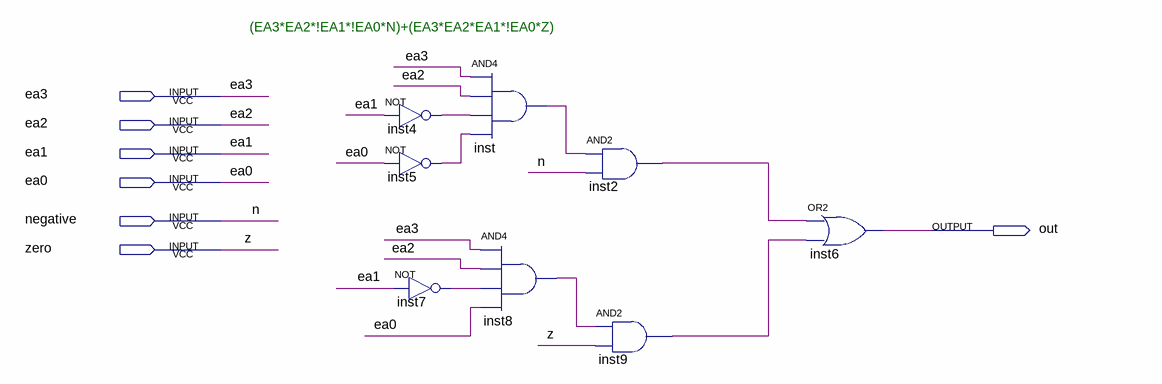
[diagram p0: schematic sheet]
// Quartus schematic jnnorjzz.bdf as structural Verilog: 8 symbols, 7 pins
module jnnorjzz (
  input  ea3,
  input  ea2,
  input  ea1,
  input  ea0,
  input  negative,
  input  zero,
  output out
);

  wire inst2_out, inst4_out, inst5_out, inst7_out, inst8_out, inst9_out, inst_out;

  not inst4 (inst4_out, ea1);
  not inst5 (inst5_out, ea0);
  not inst7 (inst7_out, ea1);
  and inst (inst_out, ea3, ea2, inst4_out, inst5_out);
  and inst8 (inst8_out, ea3, ea2, inst7_out, ea0);
  and inst2 (inst2_out, inst_out, negative);
  and inst9 (inst9_out, inst8_out, zero);
  or inst6 (out, inst2_out, inst9_out);

  // Other names for the same wires on the sheet: n = negative; z = zero

  // Notes on the sheet:
  //   (EA3*EA2*!EA1*!EA0*N)+(EA3*EA2*EA1*!EA0*Z)
endmodule
